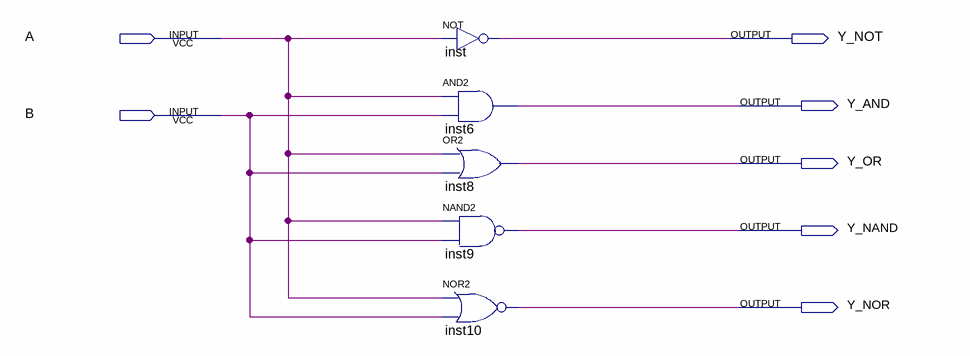
[diagram p0: schematic sheet]
// Quartus schematic BasicGates.bdf as structural Verilog: 5 symbols, 7 pins
module BasicGates (
  input  A,
  input  B,
  output Y_NOT,
  output Y_AND,
  output Y_OR,
  output Y_NAND,
  output Y_NOR
);

  not inst (Y_NOT, A);
  and inst6 (Y_AND, A, B);
  or inst8 (Y_OR, A, B);
  nand inst9 (Y_NAND, A, B);
  nor inst10 (Y_NOR, A, B);
endmodule
